# EasyEDA Pro project ProPrj_MN42_2025-04-09.epro, board btnBRD
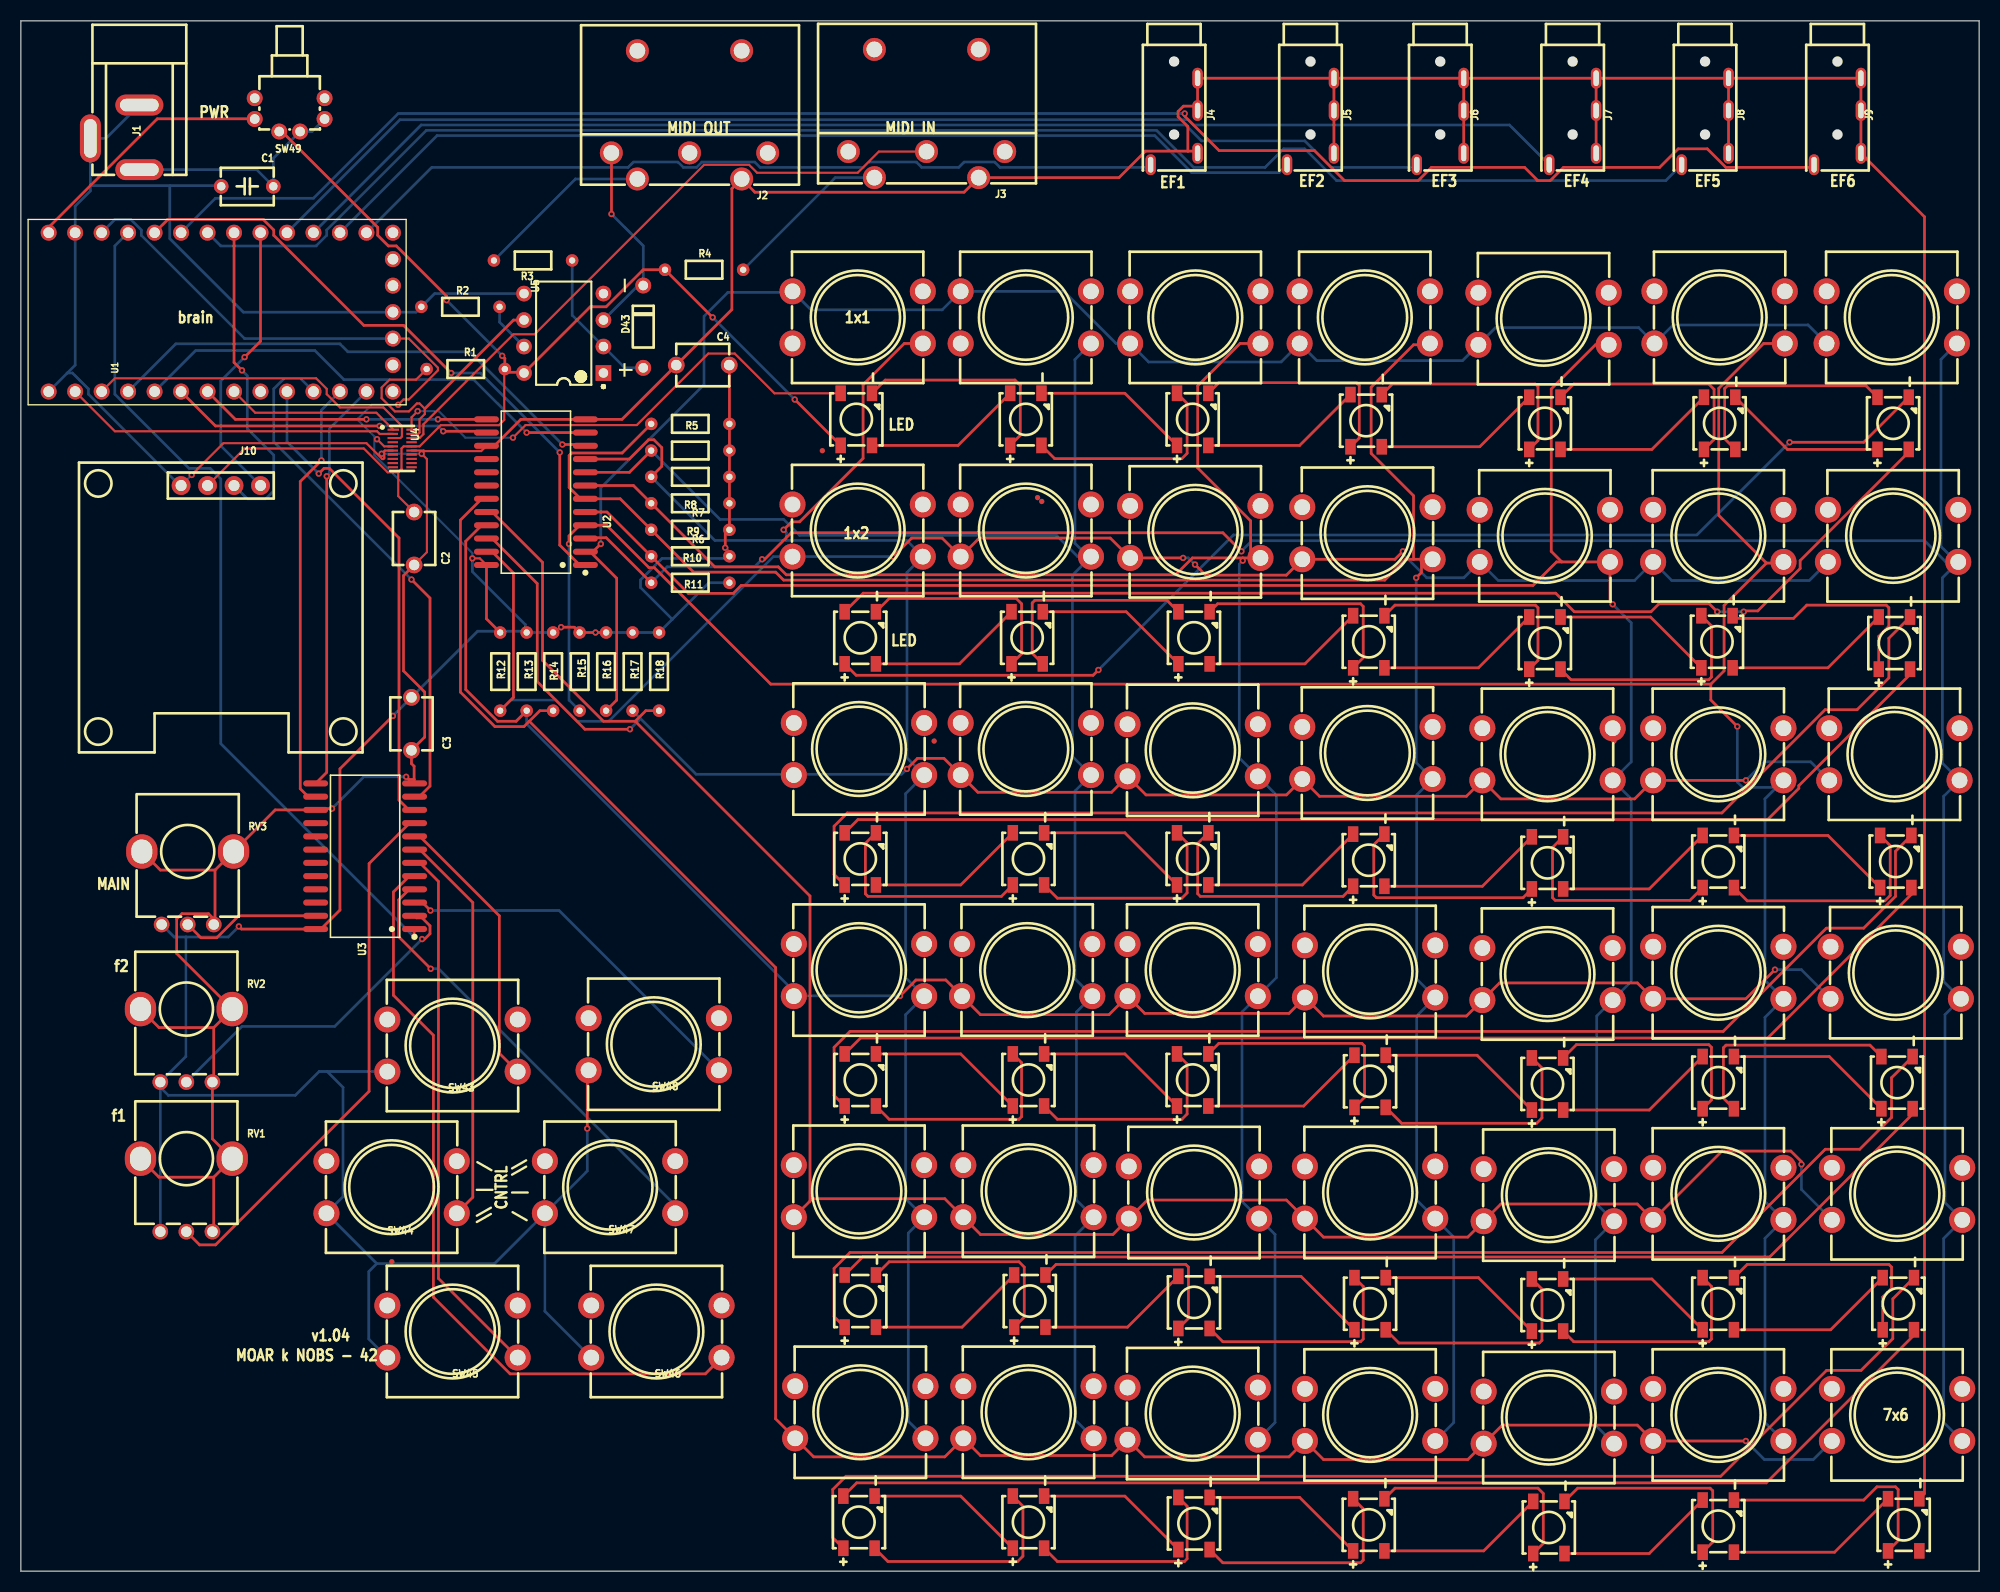
[diagram p1: board, top side]
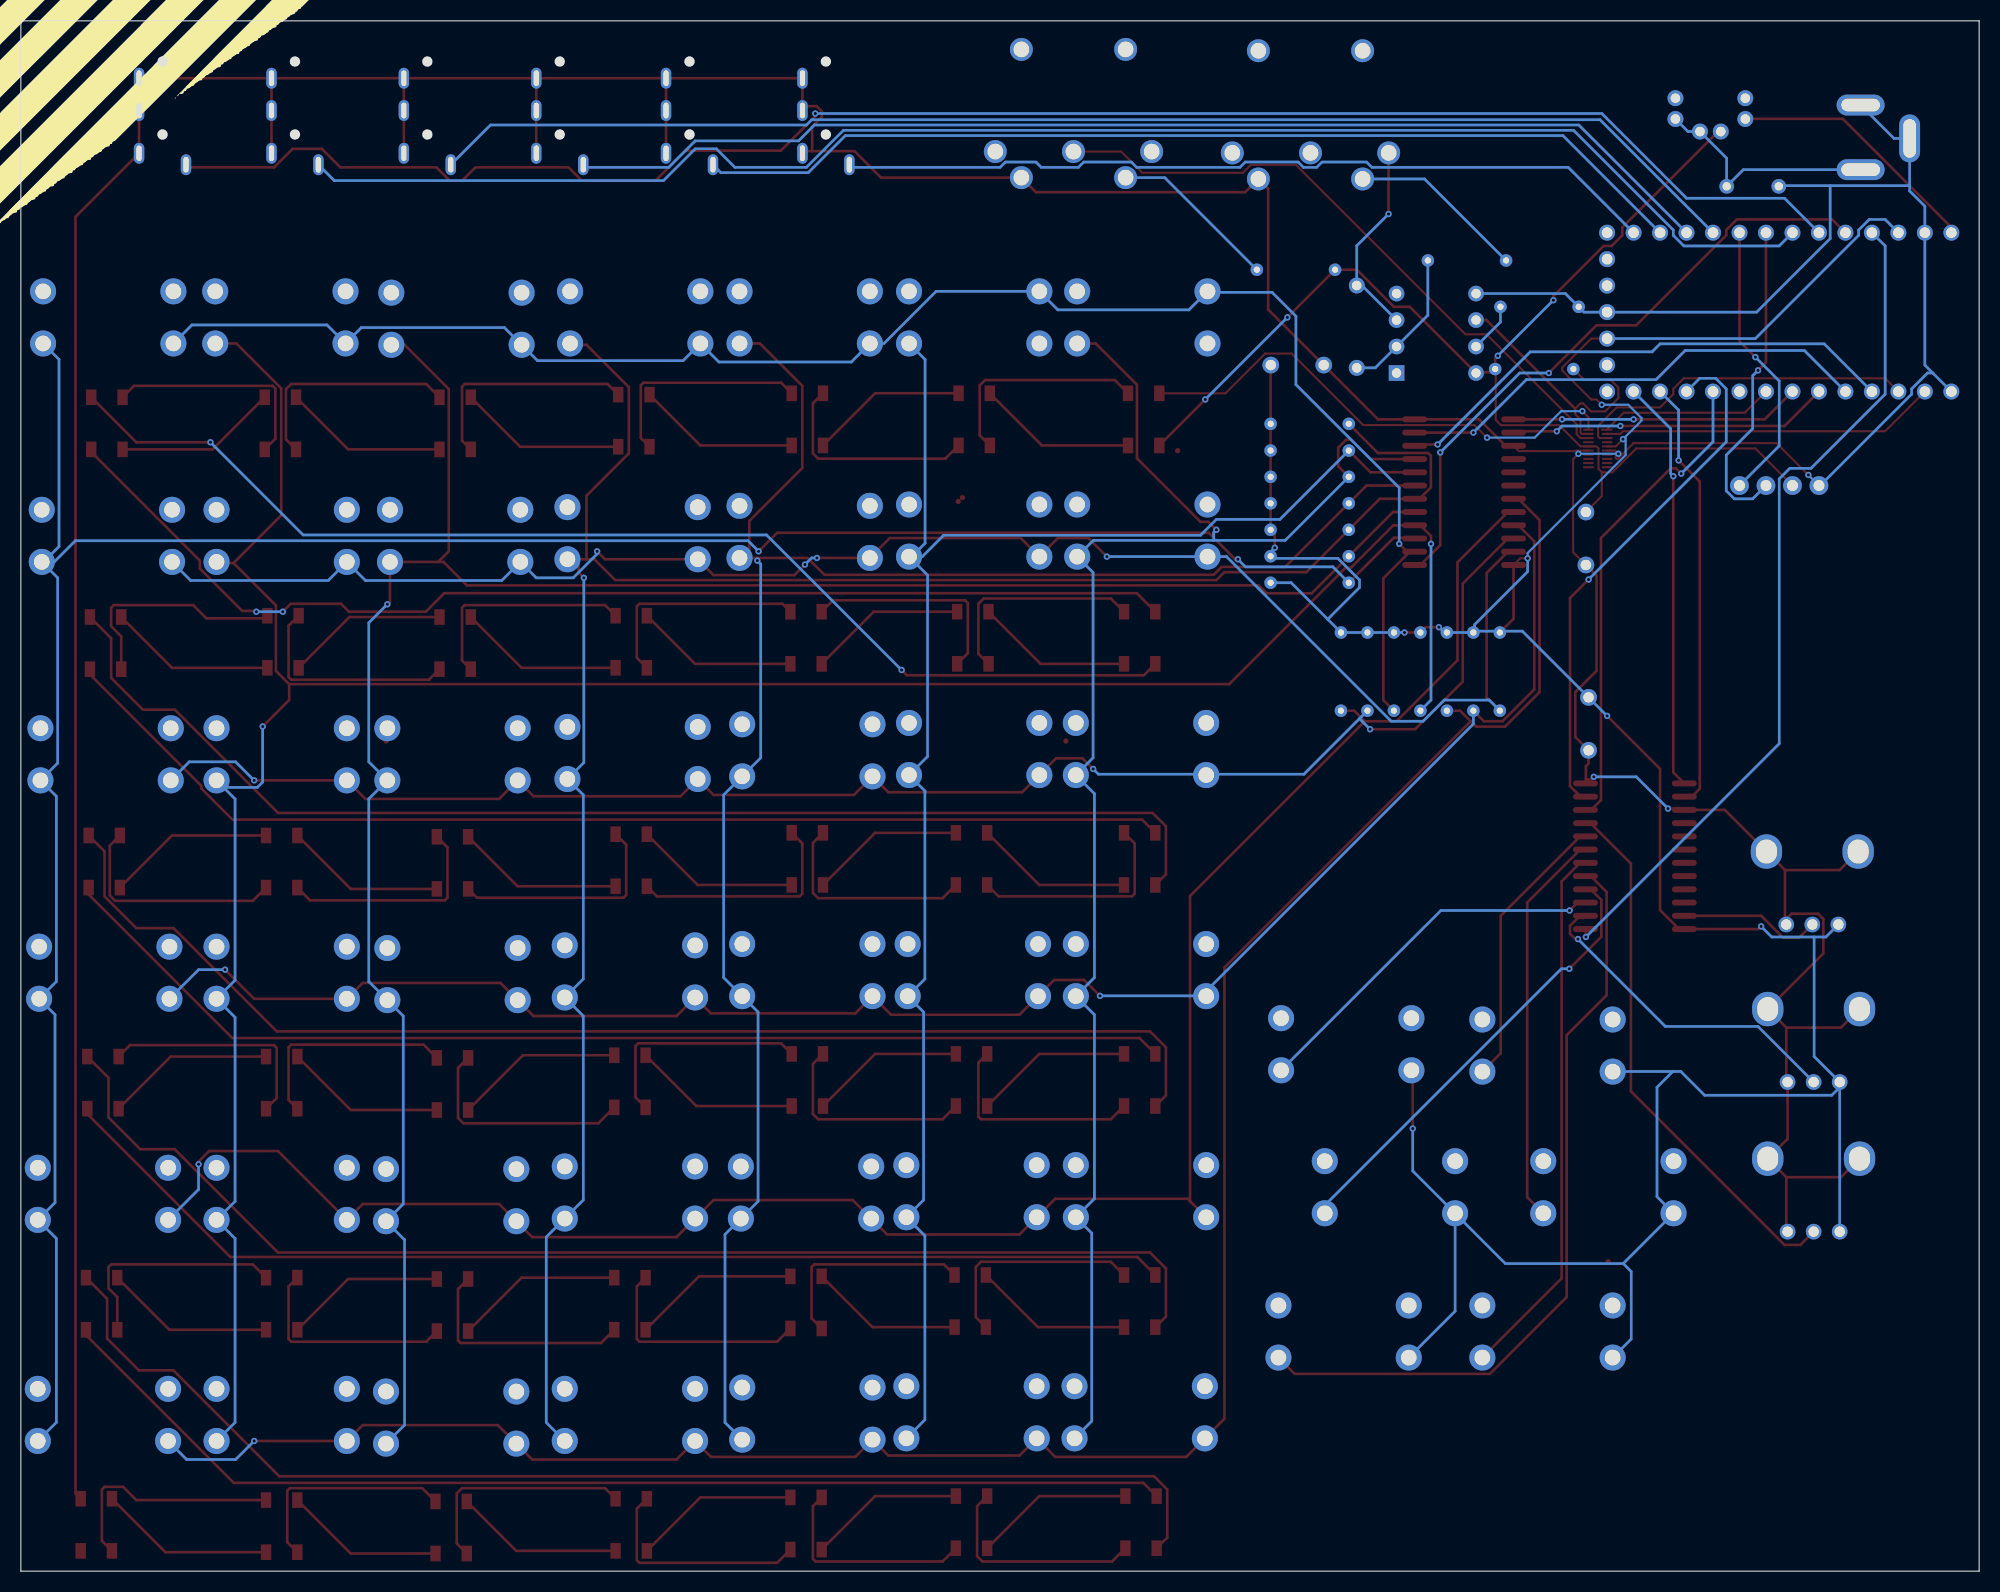
[diagram p2: board, bottom side, seen from below]

Outline 187.83 x 148.72 mm; copper layers: Top Layer, Bottom Layer. Coordinates in mm from the lower left corner of the outline.
Outline path: 0,148.72 0,0 187.83,0 187.83,148.72 0,148.72
Stack: Top Layer 0.035mm / Dielectric1 1.51mm FR4 er 4.5 / Bottom Layer 0.035mm

## Design rules (mm)
spacing safeClearance (default): track to track 0.152, other pairs 0.152 to 0.3
track width trackWidth (default): min 0.127, default 0.254, max 2.54
differential pair differentialPair (default): width min 0.127, default 0.254, max 2.54; gap min 0.152, default 0.152
via viaSize (default): diameter min 0.5, default 0.61, max 10; hole min 0.3, default 0.305, max 6

## Placement (name value [footprint] x y rotation side)
C1  10uF  [CAP-TH_L5.5-W3.5-P5.00-D0.5]  21.72 132.84 0 top
C2  100nF  [CAP-TH_L5.0-W4.0-P5.00-D1.0]  37.72 99.06 270 top
C3  100nF  [CAP-TH_L5.0-W4.0-P5.00-D1.0]  37.47 81.28 90 top
C4  100nF  [CAP-TH_L5.0-W4.0-P5.00-D1.0]  65.41 115.7 0 top
D1  XL-5050RGBC-WS2812B  [LED-SMD_4P-L5.0-W5.0-BL_XL-5050RGBC]  80.14 110.49 0 top
D2  XL-5050RGBC-WS2812B  [LED-SMD_4P-L5.0-W5.0-BL_XL-5050RGBC]  96.39 110.49 0 top
D3  XL-5050RGBC-WS2812B  [LED-SMD_4P-L5.0-W5.0-BL_XL-5050RGBC]  112.4 110.49 0 top
D4  XL-5050RGBC-WS2812B  [LED-SMD_4P-L5.0-W5.0-BL_XL-5050RGBC]  129.03 110.36 0 top
D5  XL-5050RGBC-WS2812B  [LED-SMD_4P-L5.0-W5.0-BL_XL-5050RGBC]  146.18 110.11 0 top
D6  XL-5050RGBC-WS2812B  [LED-SMD_4P-L5.0-W5.0-BL_XL-5050RGBC]  162.94 110.11 0 top
D7  XL-5050RGBC-WS2812B  [LED-SMD_4P-L5.0-W5.0-BL_XL-5050RGBC]  179.58 110.11 0 top
D8  XL-5050RGBC-WS2812B  [LED-SMD_4P-L5.0-W5.0-BL_XL-5050RGBC]  80.52 89.54 0 top
D9  XL-5050RGBC-WS2812B  [LED-SMD_4P-L5.0-W5.0-BL_XL-5050RGBC]  96.52 89.54 0 top
D10  XL-5050RGBC-WS2812B  [LED-SMD_4P-L5.0-W5.0-BL_XL-5050RGBC]  112.52 89.54 0 top
D11  XL-5050RGBC-WS2812B  [LED-SMD_4P-L5.0-W5.0-BL_XL-5050RGBC]  129.29 89.15 0 top
D12  XL-5050RGBC-WS2812B  [LED-SMD_4P-L5.0-W5.0-BL_XL-5050RGBC]  146.18 89.03 0 top
D13  XL-5050RGBC-WS2812B  [LED-SMD_4P-L5.0-W5.0-BL_XL-5050RGBC]  162.69 89.15 0 top
D14  XL-5050RGBC-WS2812B  [LED-SMD_4P-L5.0-W5.0-BL_XL-5050RGBC]  179.71 89.03 0 top
D15  XL-5050RGBC-WS2812B  [LED-SMD_4P-L5.0-W5.0-BL_XL-5050RGBC]  80.52 68.33 0 top
D16  XL-5050RGBC-WS2812B  [LED-SMD_4P-L5.0-W5.0-BL_XL-5050RGBC]  96.65 68.33 0 top
D17  XL-5050RGBC-WS2812B  [LED-SMD_4P-L5.0-W5.0-BL_XL-5050RGBC]  112.4 68.33 0 top
D18  XL-5050RGBC-WS2812B  [LED-SMD_4P-L5.0-W5.0-BL_XL-5050RGBC]  129.29 68.2 0 top
D19  XL-5050RGBC-WS2812B  [LED-SMD_4P-L5.0-W5.0-BL_XL-5050RGBC]  146.43 67.95 0 top
D20  XL-5050RGBC-WS2812B  [LED-SMD_4P-L5.0-W5.0-BL_XL-5050RGBC]  162.81 68.07 0 top
D21  XL-5050RGBC-WS2812B  [LED-SMD_4P-L5.0-W5.0-BL_XL-5050RGBC]  179.83 68.07 0 top
D22  XL-5050RGBC-WS2812B  [LED-SMD_4P-L5.0-W5.0-BL_XL-5050RGBC]  80.52 47.12 0 top
D23  XL-5050RGBC-WS2812B  [LED-SMD_4P-L5.0-W5.0-BL_XL-5050RGBC]  96.65 47.12 0 top
D24  XL-5050RGBC-WS2812B  [LED-SMD_4P-L5.0-W5.0-BL_XL-5050RGBC]  112.4 47.12 0 top
D25  XL-5050RGBC-WS2812B  [LED-SMD_4P-L5.0-W5.0-BL_XL-5050RGBC]  129.41 46.99 0 top
D26  XL-5050RGBC-WS2812B  [LED-SMD_4P-L5.0-W5.0-BL_XL-5050RGBC]  146.43 46.74 0 top
D27  XL-5050RGBC-WS2812B  [LED-SMD_4P-L5.0-W5.0-BL_XL-5050RGBC]  162.81 46.86 0 top
D28  XL-5050RGBC-WS2812B  [LED-SMD_4P-L5.0-W5.0-BL_XL-5050RGBC]  179.96 46.86 0 top
D29  XL-5050RGBC-WS2812B  [LED-SMD_4P-L5.0-W5.0-BL_XL-5050RGBC]  80.52 25.91 0 top
D30  XL-5050RGBC-WS2812B  [LED-SMD_4P-L5.0-W5.0-BL_XL-5050RGBC]  96.77 25.91 0 top
D31  XL-5050RGBC-WS2812B  [LED-SMD_4P-L5.0-W5.0-BL_XL-5050RGBC]  112.52 25.78 0 top
D32  XL-5050RGBC-WS2812B  [LED-SMD_4P-L5.0-W5.0-BL_XL-5050RGBC]  129.41 25.65 0 top
D33  XL-5050RGBC-WS2812B  [LED-SMD_4P-L5.0-W5.0-BL_XL-5050RGBC]  146.43 25.53 0 top
D34  XL-5050RGBC-WS2812B  [LED-SMD_4P-L5.0-W5.0-BL_XL-5050RGBC]  162.81 25.65 0 top
D35  XL-5050RGBC-WS2812B  [LED-SMD_4P-L5.0-W5.0-BL_XL-5050RGBC]  180.09 25.65 0 top
D36  XL-5050RGBC-WS2812B  [LED-SMD_4P-L5.0-W5.0-BL_XL-5050RGBC]  80.39 4.7 0 top
D37  XL-5050RGBC-WS2812B  [LED-SMD_4P-L5.0-W5.0-BL_XL-5050RGBC]  96.65 4.7 0 top
D38  XL-5050RGBC-WS2812B  [LED-SMD_4P-L5.0-W5.0-BL_XL-5050RGBC]  112.52 4.57 0 top
D39  XL-5050RGBC-WS2812B  [LED-SMD_4P-L5.0-W5.0-BL_XL-5050RGBC]  129.29 4.45 0 top
D40  XL-5050RGBC-WS2812B  [LED-SMD_4P-L5.0-W5.0-BL_XL-5050RGBC]  146.56 4.19 0 top
D41  XL-5050RGBC-WS2812B  [LED-SMD_4P-L5.0-W5.0-BL_XL-5050RGBC]  162.81 4.32 0 top
D42  XL-5050RGBC-WS2812B  [LED-SMD_4P-L5.0-W5.0-BL_XL-5050RGBC]  180.59 4.45 0 top
D43  1N4148PF  [DO-35_BD1.9-L3.9-P7.90-D0.5-FD]  59.7 119.38 90 top
J1  DC005  [DC-IN-TH_DC005]  9.02 137.54 270 top
J2  DIN-504B-M10  [CONN-TH_DIN-504B-M10]  64.14 139.7 180 top
J3  DIN-504B-M10  [CONN-TH_DIN-504B-M10]  86.87 139.83 180 top
J4  HC-PJ-320A  [AUDIO-SMD_HC-PJ-320A]  110.62 139.06 270 top
J5  HC-PJ-320A  [AUDIO-SMD_HC-PJ-320A]  123.7 139.06 270 top
J6  HC-PJ-320A  [AUDIO-SMD_HC-PJ-320A]  136.14 139.06 270 top
J7  HC-PJ-320A  [AUDIO-SMD_HC-PJ-320A]  148.84 139.06 270 top
J8  HC-PJ-320A  [AUDIO-SMD_HC-PJ-320A]  161.54 139.06 270 top
J9  HC-PJ-320A  [AUDIO-SMD_HC-PJ-320A]  174.24 139.06 270 top
J10  HS96L03W2C03  [OLED-TH_L27.8-W27.2-P2.54_C9900033791]  19.18 104.14 0 top
R1  220Ω  [RES-TH_BD1.7-L3.5-P7.50-D0.5]  42.67 115.32 0 top
R2  4.7kΩ  [RES-TH_BD1.7-L3.5-P7.50-D0.5]  42.16 121.29 0 top
R3  220Ω  [RES-TH_BD1.7-L3.5-P7.50-D0.5]  49.13 125.73 180 top
R4  220Ω  [RES-TH_BD1.7-L3.5-P7.50-D0.5]  65.53 124.84 0 top
R5  10kΩ  [RES-TH_BD1.7-L3.5-P7.50-D0.5]  64.21 110.06 0 top
R6  10kΩ  [RES-TH_BD1.7-L3.5-P7.50-D0.5]  64.21 107.5 0 top
R7  10kΩ  [RES-TH_BD1.7-L3.5-P7.50-D0.5]  64.21 104.98 0 top
R8  10kΩ  [RES-TH_BD1.7-L3.5-P7.50-D0.5]  64.21 102.44 0 top
R9  10kΩ  [RES-TH_BD1.7-L3.5-P7.50-D0.5]  64.21 99.9 0 top
R10  10kΩ  [RES-TH_BD1.7-L3.5-P7.50-D0.5]  64.21 97.36 0 top
R11  10kΩ  [RES-TH_BD1.7-L3.5-P7.50-D0.5]  64.21 94.82 0 top
R12  10kΩ  [RES-TH_BD1.7-L3.5-P7.50-D0.5]  45.97 86.29 90 top
R13  10kΩ  [RES-TH_BD1.7-L3.5-P7.50-D0.5]  48.51 86.29 90 top
R14  10kΩ  [RES-TH_BD1.7-L3.5-P7.50-D0.5]  51.05 86.29 90 top
R15  10kΩ  [RES-TH_BD1.7-L3.5-P7.50-D0.5]  53.59 86.29 90 top
R16  10kΩ  [RES-TH_BD1.7-L3.5-P7.50-D0.5]  56.13 86.29 90 top
R17  10kΩ  [RES-TH_BD1.7-L3.5-P7.50-D0.5]  58.67 86.29 90 top
R18  10kΩ  [RES-TH_BD1.7-L3.5-P7.50-D0.5]  61.21 86.29 90 top
RV1  10kΩ  [RES-ADJ-TH_RK09K1130A5R]  15.88 36.07 0 top
RV2  10kΩ  [RES-ADJ-TH_RK09K1130A5R]  15.88 50.42 0 top
RV3  10kΩ  [RES-ADJ-TH_RK09K1130A5R]  16 65.53 0 top
SW1  HX B3F-4055-Y  [SW-TH_4P-L12.0-W12.0-P5.00-LS12.5]  80.26 120.27 180 top
SW2  HX B3F-4055-Y  [SW-TH_4P-L12.0-W12.0-P5.00-LS12.5]  96.39 120.27 180 top
SW3  HX B3F-4055-Y  [SW-TH_4P-L12.0-W12.0-P5.00-LS12.5]  112.65 120.27 180 top
SW4  HX B3F-4055-Y  [SW-TH_4P-L12.0-W12.0-P5.00-LS12.5]  128.91 120.27 180 top
SW5  HX B3F-4055-Y  [SW-TH_4P-L12.0-W12.0-P5.00-LS12.5]  146.05 120.14 180 top
SW6  HX B3F-4055-Y  [SW-TH_4P-L12.0-W12.0-P5.00-LS12.5]  162.94 120.27 180 top
SW7  HX B3F-4055-Y  [SW-TH_4P-L12.0-W12.0-P5.00-LS12.5]  179.45 120.27 180 top
SW8  HX B3F-4055-Y  [SW-TH_4P-L12.0-W12.0-P5.00-LS12.5]  80.26 99.82 180 top
SW9  HX B3F-4055-Y  [SW-TH_4P-L12.0-W12.0-P5.00-LS12.5]  96.39 99.82 180 top
SW10  HX B3F-4055-Y  [SW-TH_4P-L12.0-W12.0-P5.00-LS12.5]  112.65 99.7 180 top
SW11  HX B3F-4055-Y  [SW-TH_4P-L12.0-W12.0-P5.00-LS12.5]  129.16 99.57 180 top
SW12  HX B3F-4055-Y  [SW-TH_4P-L12.0-W12.0-P5.00-LS12.5]  146.18 99.31 180 top
SW13  HX B3F-4055-Y  [SW-TH_4P-L12.0-W12.0-P5.00-LS12.5]  162.81 99.31 180 top
SW14  HX B3F-4055-Y  [SW-TH_4P-L12.0-W12.0-P5.00-LS12.5]  179.58 99.31 180 top
SW15  HX B3F-4055-Y  [SW-TH_4P-L12.0-W12.0-P5.00-LS12.5]  80.39 78.87 180 top
SW16  HX B3F-4055-Y  [SW-TH_4P-L12.0-W12.0-P5.00-LS12.5]  96.39 78.87 180 top
SW17  HX B3F-4055-Y  [SW-TH_4P-L12.0-W12.0-P5.00-LS12.5]  112.4 78.74 180 top
SW18  HX B3F-4055-Y  [SW-TH_4P-L12.0-W12.0-P5.00-LS12.5]  129.16 78.49 180 top
SW19  HX B3F-4055-Y  [SW-TH_4P-L12.0-W12.0-P5.00-LS12.5]  146.43 78.36 180 top
SW20  HX B3F-4055-Y  [SW-TH_4P-L12.0-W12.0-P5.00-LS12.5]  162.81 78.36 180 top
SW21  HX B3F-4055-Y  [SW-TH_4P-L12.0-W12.0-P5.00-LS12.5]  179.71 78.36 180 top
SW22  HX B3F-4055-Y  [SW-TH_4P-L12.0-W12.0-P5.00-LS12.5]  80.39 57.66 180 top
SW23  HX B3F-4055-Y  [SW-TH_4P-L12.0-W12.0-P5.00-LS12.5]  96.52 57.66 180 top
SW24  HX B3F-4055-Y  [SW-TH_4P-L12.0-W12.0-P5.00-LS12.5]  112.4 57.66 180 top
SW25  HX B3F-4055-Y  [SW-TH_4P-L12.0-W12.0-P5.00-LS12.5]  129.41 57.53 180 top
SW26  HX B3F-4055-Y  [SW-TH_4P-L12.0-W12.0-P5.00-LS12.5]  146.43 57.28 180 top
SW27  HX B3F-4055-Y  [SW-TH_4P-L12.0-W12.0-P5.00-LS12.5]  162.81 57.4 180 top
SW28  HX B3F-4055-Y  [SW-TH_4P-L12.0-W12.0-P5.00-LS12.5]  179.83 57.4 180 top
SW29  HX B3F-4055-Y  [SW-TH_4P-L12.0-W12.0-P5.00-LS12.5]  80.39 36.45 180 top
SW30  HX B3F-4055-Y  [SW-TH_4P-L12.0-W12.0-P5.00-LS12.5]  96.65 36.45 180 top
SW31  HX B3F-4055-Y  [SW-TH_4P-L12.0-W12.0-P5.00-LS12.5]  112.52 36.32 180 top
SW32  HX B3F-4055-Y  [SW-TH_4P-L12.0-W12.0-P5.00-LS12.5]  129.41 36.32 180 top
SW33  HX B3F-4055-Y  [SW-TH_4P-L12.0-W12.0-P5.00-LS12.5]  146.56 36.07 180 top
SW34  HX B3F-4055-Y  [SW-TH_4P-L12.0-W12.0-P5.00-LS12.5]  162.81 36.2 180 top
SW35  HX B3F-4055-Y  [SW-TH_4P-L12.0-W12.0-P5.00-LS12.5]  179.96 36.2 180 top
SW36  HX B3F-4055-Y  [SW-TH_4P-L12.0-W12.0-P5.00-LS12.5]  80.52 15.24 180 top
SW37  HX B3F-4055-Y  [SW-TH_4P-L12.0-W12.0-P5.00-LS12.5]  96.65 15.24 180 top
SW38  HX B3F-4055-Y  [SW-TH_4P-L12.0-W12.0-P5.00-LS12.5]  112.4 15.11 180 top
SW39  HX B3F-4055-Y  [SW-TH_4P-L12.0-W12.0-P5.00-LS12.5]  129.41 14.99 180 top
SW40  HX B3F-4055-Y  [SW-TH_4P-L12.0-W12.0-P5.00-LS12.5]  146.56 14.73 180 top
SW41  HX B3F-4055-Y  [SW-TH_4P-L12.0-W12.0-P5.00-LS12.5]  162.81 14.99 180 top
SW42  HX B3F-4055-Y  [SW-TH_4P-L12.0-W12.0-P5.00-LS12.5]  179.96 14.99 180 top
SW43  HX B3F-4055-Y  [SW-TH_4P-L12.0-W12.0-P5.00-LS12.5]  41.4 50.42 180 top
SW44  HX B3F-4055-Y  [SW-TH_4P-L12.0-W12.0-P5.00-LS12.5]  35.56 36.83 180 top
SW45  HX B3F-4055-Y  [SW-TH_4P-L12.0-W12.0-P5.00-LS12.5]  41.4 22.99 180 top
SW46  HX B3F-4055-Y  [SW-TH_4P-L12.0-W12.0-P5.00-LS12.5]  60.96 22.99 180 top
SW47  HX B3F-4055-Y  [SW-TH_4P-L12.0-W12.0-P5.00-LS12.5]  56.52 36.83 180 top
SW48  HX B3F-4055-Y  [SW-TH_4P-L12.0-W12.0-P5.00-LS12.5]  60.71 50.55 180 top
SW49  pwr switch  [SW-TH_TK-6580A-1]  25.78 139.7 180 top
U1  brain - teensy 4.0  [teensy 4.0:MODULE_DEV-15583]  19.18 120.78 90 top
U2  CD74HC4067M96  [SOIC-24_L15.4-W7.5-P1.27-LS10.3-BL]  49.4 103.51 90 top
U3  CD74HC4067M96  [SOIC-24_L15.4-W7.5-P1.27-LS10.3-BL]  33.02 68.58 90 top
U4  TXB0108DQSR  [SON-20_L4.0-W2.0-P0.40-BL]  36.58 107.7 270 top
U5  6N138  [DIP-8_L9.8-W6.6-P2.54-LS7.6-BL]  52.07 118.75 90 top

## Footprints (pads in the part's own frame, mm; a bottom-side part is the same pattern mirrored in y, then rotated)
AUDIO-SMD_HC-PJ-320A
  oval 2x1 hole 1.5x0.5: 1(4.15,-2.25) 2(-4.15,2.25) 3(-1.05,2.25) 4(3.05,2.25)
CAP-TH_L5.0-W4.0-P5.00-D1.0
  round 1.6 hole 1: 1(-2.54,0) 2(2.54,0)
CAP-TH_L5.5-W3.5-P5.00-D0.5
  round 1.4 hole 0.8: 1(-2.5,0) 2(2.5,0)
CONN-TH_DIN-504B-M10
  round 2.2 hole 1.5: 1(-7.5,3.65) 2(-5,6.15) 3(0,3.65) 4(5,6.15) 5(7.5,3.65) 6(-5,-6.15) 7(5,-6.15)
DC-IN-TH_DC005
  oval 2x4.6 hole 1.2x3.7: 1(3.1,2.35) 2(-3.1,2.35)
  oval 4.6x2 hole 3.7x1.2: 3(0.1,-2.35)
DIP-8_L9.8-W6.6-P2.54-LS7.6-BL
  rect 1.5x1.5 hole 0.9: 1(-3.81,-3.81)
  round 1.5 hole 0.9: 2(-1.27,-3.81) 3(1.27,-3.81) 4(3.81,-3.81) 5(3.81,3.81) 6(1.27,3.81) 7(-1.27,3.81) 8(-3.81,3.81)
DO-35_BD1.9-L3.9-P7.90-D0.5-FD
  round 1.524 hole 0.914: 1(-3.95,0) 2(3.95,0)
LED-SMD_4P-L5.0-W5.0-BL_XL-5050RGBC
  rect 1x1.5 smd: 1(-1.5,-2.5) 2(1.5,-2.5) 3(1.5,2.5) 4(-1.5,2.5)
OLED-TH_L27.8-W27.2-P2.54_C9900033791
  round 1.8 hole 1.05: 1(-3.81,0) 2(-1.27,0) 3(1.27,0) 4(3.81,0)
RES-ADJ-TH_RK09K1130A5R
  round 1.5 hole 1: 1(-2.5,-3.5) 2(0,-3.5) 3(2.5,-3.5)
  oval 3x3.3 hole 2x2.3: 4(4.4,3.5) 5(-4.4,3.5)
RES-TH_BD1.7-L3.5-P7.50-D0.5
  round 1.2 hole 0.6: 1(-3.75,0) 2(3.75,0)
SOIC-24_L15.4-W7.5-P1.27-LS10.3-BL
  oval 0.574x2.388 smd: 1(-6.985,-4.744) 2(-5.715,-4.744) 3(-4.445,-4.744) 4(-3.175,-4.744) 5(-1.905,-4.744) 6(-0.635,-4.744) 7(0.635,-4.744) 8(1.905,-4.744) 9(3.175,-4.744) 10(4.445,-4.744) 11(5.715,-4.744) 12(6.985,-4.744) 13(6.985,4.744) 14(5.715,4.744) 15(4.445,4.744) 16(3.175,4.744) 17(1.905,4.744) 18(0.635,4.744) 19(-0.635,4.744) 20(-1.905,4.744) 21(-3.175,4.744) 22(-4.445,4.744) 23(-5.715,4.744) 24(-6.985,4.744)
SON-20_L4.0-W2.0-P0.40-BL
  rect 0.2x1.1 smd: 1(-1.8,-0.85)
  rect 0.2x1 smd: 2(-1.4,-0.9) 3(-1,-0.9) 4(-0.6,-0.9) 5(-0.2,-0.9) 6(0.2,-0.9) 7(0.6,-0.9) 8(1,-0.9) 9(1.4,-0.9) 10(1.8,-0.9) 11(1.8,0.9) 12(1.4,0.9) 13(1,0.9) 14(0.6,0.9) 15(0.2,0.9) 16(-0.2,0.9) 17(-0.6,0.9) 18(-1,0.9) 19(-1.4,0.9) 20(-1.8,0.9)
SW-TH_4P-L12.0-W12.0-P5.00-LS12.5
  round 2.5 hole 1.5: 1(-6.25,2.5) 2(6.25,2.5) 3(-6.25,-2.5) 4(6.25,-2.5)
SW-TH_TK-6580A-1
  round 1.524 hole 0.914: 1(3.35,-1.6) 2(3.35,0.4) 3(-3.35,-1.6) 4(-3.35,0.4) 5(1,1.6) 6(-1,1.6)
teensy 4.0:MODULE_DEV-15583
  round 1.53 hole 1.02: 0(-7.62,13.97) 1(-7.62,11.43) 2(-7.62,8.89) 3(-7.62,6.35) 3.3V_1(-2.54,-16.51) 3.3V_2(7.62,11.43) 4(-7.62,3.81) 5(-7.62,1.27) 6(-7.62,-1.27) 7(-7.62,-3.81) 8(-7.62,-6.35) 9(-7.62,-8.89) 10(-7.62,-11.43) 11(-7.62,-13.97) 12(-7.62,-16.51) 13(7.62,-16.51) 14(7.62,-13.97) 15(7.62,-11.43) 16(7.62,-8.89) 17(7.62,-6.35) 18(7.62,-3.81) 19(7.62,-1.27) 20(7.62,1.27) 21(7.62,3.81) 22(7.62,6.35) 23(7.62,8.89) G1(-7.62,16.51) G2(0,-16.51) G3(7.62,13.97) ON-OFF(5.08,-16.51) PGM(2.54,-16.51) VBAT(-5.08,-16.51) VIN(7.62,16.51)

## Nets
As in the schematic.

Pads without a net: D42 2; J2 1 3 6 7; J3 1 5 6 7; SW1 2 3; SW2 2 3; SW3 3 4; SW4 3 4; SW5 3 4; SW6 3 4; SW7 3 4; SW8 3 4; SW9 3 4; SW10 3 4; SW11 3 4; SW12 3 4; SW13 3 4; SW14 3 4; SW15 3 4; SW16 3 4; SW17 3 4; SW18 3 4; SW19 3 4; SW20 3 4; SW21 3 4; SW22 3 4; SW23 3 4; SW24 3 4; SW25 3 4; SW26 3 4; SW27 3 4; SW28 3 4; SW29 3 4; SW30 3 4; SW31 3 4; SW32 3 4; SW33 3 4; SW34 3 4; SW35 3 4; SW36 3 4; SW37 3 4; SW38 3 4; SW39 3 4; SW40 3 4; SW41 3 4; SW42 3 4; SW43 3 4; SW44 3 4; SW45 3 4; SW46 3 4; SW47 3 4; SW48 3 4; SW49 1 3; U1 7 12 13 ON-OFF PGM VBAT; U2 16 17 18; U3 16 17 18 19 20 21 22; U4 4 7 8 9 10 11 12 13 14 17; U5 1 4

## Via types
v1: diameter 0.61, hole 0.305, Top Layer to Bottom Layer, 64 vias

## Routing (per net, layer and track width the routed paths; a pad name or vN(x,y) marks a point on that pad's centre or on a via; arc(x,y) is an arc through that point)
3VDC: length 331.8
  Top Layer w0.2: v1(36.2,111.89) 36.7,112.4 37.21,112.4 40,115.19 40,115.44 37.21,118.24 U1.3.3V_1 ; v1(43.31,97.16) 44.02,97.16 U2.24 ; v1(34.16,108.59) 34.85,107.9 U4.5
  Top Layer w0.254: v1(20.91,61.85) 21.16,61.6 U3.24 28.78,61.6 30.61,63.42 30.61,76.96 v1(35.69,82.04) ; v1(67.56,98.17) 67.56,99.5 R9.2 R8.2 R7.2 R6.2 R5.2 67.96,115.68 C4.2 ; v1(51.82,90.55) 53.09,90.55 R15.2 v1(55.12,90.04) R16.2 ; R12.2 44.66,91.36 U2.24 ; SW48.2 54.33,47.92 v1(54.33,42.46)
  Bottom Layer w0.2: 33.91,108.84 33.91,107.06 43.31,97.66 v1(43.31,97.16) ; 33.91,108.84 32.39,110.36 32.39,110.62 33.66,111.89 v1(36.2,111.89) ; 33.91,108.84 v1(34.16,108.59)
  Bottom Layer w0.254: 29.38,47.94 30.9,46.41 30.9,35.92 SW44.2 34.14,29.5 ; 29.38,47.94 28.61,47.94 26.33,45.65 14.14,45.65 13.38,46.41 ; 29.38,47.94 35.14,47.94 SW43.2 ; 34.14,29.5 45.44,29.5 SW47.2 ; 34.14,29.5 33.37,28.74 33.37,22.27 SW45.2 ; v1(55.12,90.04) R16.2 R17.2 R18.2 62.48,91.31 ; 67.82,97.41 67.56,97.15 61.51,97.15 59.44,95.08 59.44,94.36 62.48,91.31 ; 67.82,97.41 67.82,97.92 v1(67.56,98.17) ; 67.82,97.41 R10.2 ; v1(54.33,42.46) 54.33,38.39 SW47.2 ; 15.83,60.83 19.89,60.83 v1(20.91,61.85) ; 15.83,60.83 14.7,60.83 RV3.1 ; 15.83,60.83 15.83,49.37 RV2.1 13.38,46.41 ; SW47.2 50.27,24.93 SW46.2 ; 48.39,90.17 43.81,90.17 C3.2 v1(35.69,82.04) ; 48.39,90.17 R13.2 R14.2 51.31,90.04 v1(51.82,90.55) ; 48.39,90.17 48.39,90.81 43.31,95.89 v1(43.31,97.16) ; U1.3.3V_2 9.02,129.67 10.54,129.67 11.56,128.65 11.56,128.14 21.46,118.24 U1.3.3V_1 ; 13.38,46.41 RV1.1 ; 62.48,91.31 65.99,94.82 R11.2
5VDC: length 119.2
  Top Layer w0.2: 36.2,105.41 35.18,105.41 32.89,107.7 21.46,107.7 J10.2 ; 36.2,105.41 36.51,105.73 36.51,107.7 36.71,107.9 U4.16 38.24,107.9 40.27,109.93 45.86,109.93 46.37,110.44 46.37,115.26 R1.2 ; 36.2,105.41 36.2,103.12 C2.1
  Top Layer w0.254: v1(40.83,121.92) 40.83,122.3 36.01,127.13 35.25,127.13 34.23,128.14 34.23,128.91 25.09,138.05 24.83,138.05 SW49.5 ; v1(46.17,116.59) 46.42,116.33 R1.2 ; 74.23,112.4 D1.1 ; v1(66.35,120.27) R4.1 59.69,124.84 56.13,121.29 54.61,121.29 U5.8 48.19,115.01 46.37,115.01
  Bottom Layer w0.254: v1(66.35,120.27) v1(74.23,112.4) ; v1(46.17,116.59) v1(40.83,121.92)
GND: length 591.2
  Top Layer w0.2: U4.15 38.64,107.5 38.69,107.44 ; C2.2 38.95,97.75 38.95,106.68 v1(38.44,107.19) 38.69,107.44 ; U4.6 34.91,107.5 34.86,107.44 34.86,107.19 ; v1(16.38,105.16) 19.43,108.2 33.15,108.2 34.67,106.68 34.77,106.68 34.86,106.77 34.86,107.19 ; 38.69,107.44 44.15,107.44 U2.15 ; 34.86,107.19 v1(34.61,107.19)
  Top Layer w0.254: J7.2 J8.2 ; J7.2 J7.3 J7.4 ; J7.2 J6.2 ; J8.2 J8.3 J8.4 ; J8.2 J9.2 J9.3 J9.4 182.59,129.92 182.59,7.44 D42.3 ; 18.5,37.79 13.25,37.79 RV1.5 ; 18.5,37.79 RV1.4 18.38,41.47 RV2.3 18.5,47.04 18.5,52.14 ; 18.5,37.79 18.5,32.69 RV1.3 ; 37.72,75.95 37.21,75.95 v1(36.96,76.2) ; 37.72,75.95 37.72,75.61 U3.12 ; 37.72,75.95 37.72,77.22 37.47,77.47 C3.1 38.73,80.01 38.73,84.33 36.7,86.36 36.7,95.5 C2.2 ; 111.93,136.22 112.66,136.22 J4.4 ; 111.93,136.22 111.93,138.59 111,139.52 111,140.03 111.51,140.54 112.45,140.54 J4.3 J4.2 J5.2 ; 111.93,136.22 107.87,136.22 105.33,133.68 J3.2 90.47,132.28 70.41,132.28 J2.2 68.2,132.61 68.2,121.03 C4.1 57.66,110.49 U2.12 47.96,110.49 45.42,107.95 U2.15 ; v1(29.84,73.15) 28.4,73.15 U3.15 24.39,73.03 RV3.4 18.62,67.25 ; RV2.5 13.25,52.14 18.5,52.14 ; J6.2 J6.3 J6.4 ; J6.2 J5.2 ; 18.5,62.56 18.62,62.68 18.62,67.25 ; 18.5,62.56 17.99,63.07 15.45,63.07 14.95,62.56 14.95,59.25 RV2.4 18.5,52.14 ; 18.5,62.56 RV3.3 ; 11.6,69.03 13.38,67.25 18.62,67.25 ; J5.2 J5.3 J5.4
  Bottom Layer w0.2: J10.1 v1(16.38,105.16) ; v1(34.61,107.19) v1(38.44,107.19)
  Bottom Layer w0.254: 6.67,132.91 6.67,132.4 5.21,130.94 U1.G3 5.21,115.7 4.45,114.94 ; 6.67,132.91 J1.3 8.17,137.44 J1.2 ; 6.67,132.91 14.29,132.91 ; U1.G1 4.45,114.94 ; 4.45,114.94 4.95,114.94 6.48,113.41 6.48,112.9 15.11,104.27 15.24,104.27 J10.1 ; 14.29,132.91 19.15,132.91 C1.1 ; 14.29,132.91 14.29,127.83 21.33,120.78 U1.G2 37.91,120.78 R2.1 39.68,122.56 48.26,122.56 ; v1(29.84,73.15) 32.89,76.2 v1(36.96,76.2)
COL1: length 162.2
  Top Layer w0.254: R16.1 57.15,83.56 57.15,95.24 54.61,97.78 ; 54.61,97.78 54.16,97.78 U2.2 ; 54.61,97.78 54.86,97.78 v1(55.63,98.54)
  Bottom Layer w0.254: v1(55.63,98.54) 55.63,103.92 65.53,113.83 65.53,120.39 67.82,122.67 73.92,122.67 SW1.4 75.79,120.99 88.37,120.99 SW2.4 100.05,122.77 105.05,117.77 SW3.2 108.18,115.99 120.88,115.99 SW4.2 124.31,116.12 138.28,116.12 SW5.2 141.45,119.29 155.17,119.29 SW6.2 158.47,119.55 171.42,119.55 SW7.2
COL2: length 161.7
  Top Layer w0.254: v1(111.48,97.2) SW10.2 104.49,99.1 91.92,99.1 SW9.2 88.37,99.1 85.44,99.1 v1(83.67,97.32) ; v1(112.62,96.56) 113.64,95.54 121.38,95.54 SW11.2 131.8,97.07 v1(132.56,97.83) ; U2.23 45.2,97.79 47.24,95.75 47.24,83.81 R12.1
  Bottom Layer w0.254: SW14.2 171.55,95.04 158.34,95.04 SW13.2 154.79,95.04 141.71,95.04 SW12.2 138.4,95.29 134.85,95.29 132.56,97.58 v1(132.56,97.83) ; v1(111.48,97.2) 111.99,97.2 v1(112.62,96.56) ; v1(83.67,97.32) SW8.2 72.18,97.32 56.39,81.53 53.34,81.53 51.31,83.56 46.99,83.56 R12.1
COL3: length 153.9
  Top Layer w0.254: U2.22 44.67,99.05 45.21,99.05 49.53,94.73 49.53,85.34 54.1,80.76 v1(58.42,80.76) ; v1(165.45,75.86) SW20.2 154.79,74.08 141.96,74.08 SW19.2 138.66,74.34 124.56,74.34 SW18.2 121.38,74.46 107.92,74.46 SW17.2 104.62,74.72 91.79,74.72 SW16.2 88.54,77.97 86,77.97 v1(84.98,76.95)
  Bottom Layer w0.254: v1(84.98,76.95) 84.48,76.45 74.06,76.45 ; 74.06,76.45 64.77,76.45 59.44,81.78 ; 74.06,76.45 SW15.2 ; R17.1 59.44,81.78 ; 59.44,81.78 v1(58.42,80.76) ; v1(165.45,75.86) 167.23,77.64 171.68,77.64 SW21.2
COL4: length 170.9
  Top Layer w0.254: R13.1 47.5,81.53 45.72,81.53 42.67,84.57 42.67,98.8 44.2,100.33 U2.21 ; v1(84.33,55.19) 85.85,56.71 88.72,56.71 SW23.2 92.05,53.38 104.37,53.38 SW24.2 107.8,53.51 121.64,53.51 SW25.2 124.94,53.25 138.66,53.25 SW26.2 141.83,56.43 155.04,56.43 SW27.2 165.45,54.9 v1(168.25,57.7)
  Bottom Layer w0.254: SW28.2 170.79,57.7 v1(168.25,57.7) ; 74.17,55.19 74.17,55.62 48.51,81.27 R13.1 ; 74.17,55.19 SW22.2 ; 74.17,55.19 v1(84.33,55.19)
COL5: length 197.3
  Top Layer w0.254: v1(170.79,39.03) 170.79,39.28 169.77,40.3 163.17,40.3 SW34.2 155.04,35.22 141.96,35.22 SW33.2 138.78,32.04 124.94,32.04 SW32.2 121.38,35.6 108.05,35.6 SW31.2 104.75,32.3 92.05,32.3 SW30.2 88.62,35.73 75.92,35.73 75.69,35.5 ; 58.93,81.53 75.69,64.76 75.69,35.5 ; 58.93,81.53 55.88,81.53 50.04,87.37 50.04,96.77 45.21,101.59 44.67,101.59 U2.20 ; 58.93,81.53 59.94,82.54 R18.1 ; SW29.2 75.69,35.5
  Bottom Layer w0.254: SW35.2 170.79,36.62 v1(170.79,39.03)
COL6: length 217.8
  Top Layer w0.254: 48.77,81.53 48.26,81.02 45.47,81.02 42.16,84.32 42.16,100.83 44.2,102.87 U2.19 ; 48.77,81.53 49.78,82.54 R14.1 ; 48.77,81.53 72.39,57.9 72.39,14.62 SW36.2 76.05,10.96 88.62,10.96 SW37.2 92.05,11.09 104.62,11.09 SW38.2 107.8,10.96 121.64,10.96 SW39.2 124.94,10.71 138.78,10.71 SW40.2 142.09,14.01 155.04,14.01 SW41.2 v1(165.45,12.49)
  Bottom Layer w0.254: v1(165.45,12.49) 167.23,10.71 171.93,10.71 SW42.2
CTRL1: length 27
  Top Layer w0.254: U3.8 38.27,70.49 45.89,62.87 45.89,49.68 SW43.1
CTRL2: length 38.1
  Top Layer w0.254: SW44.1 43.35,35.87 43.35,64.14 38.27,69.22 U3.7
CTRL3: length 51.9
  Top Layer w0.254: SW45.1 40.05,28.09 40.05,66.17 38.27,67.95 U3.6
CTRL4: length 74.5
  Top Layer w0.254: SW46.1 65.65,18.92 46.93,18.92 39.56,26.29 39.56,51.41 35.73,55.25 35.73,65.15 37.26,66.68 U3.5
CTRL5: length 43.4
  Top Layer w0.254: v1(39.31,57.79) 36.24,60.86 36.24,64.39 37.26,65.41 U3.4
  Bottom Layer w0.254: SW47.1 62.68,34.42 62.68,35.18 40.07,57.79 v1(39.31,57.79)
CTRL6: length 35.9
  Top Layer w0.254: U3.3 38.53,64.14 v1(39.29,63.37)
  Bottom Layer w0.254: v1(39.29,63.37) 51.63,63.37 SW48.1
E1: length 79.6
  Bottom Layer w0.254: J4.1 108.11,134.66 93.91,134.66 93.41,135.17 90.47,135.17 89.96,134.66 86.4,134.66 85.89,135.17 81.32,135.17 80.81,134.66 70.91,134.66 70.4,135.17 65.32,135.17 64.81,134.66 63.54,134.66 63.03,135.17 58.75,135.17 58.25,134.66 39.41,134.66 U1.14
E2: length 96.5
  Bottom Layer w0.254: J5.1 120.69,134.15 112.31,134.15 108.75,137.71 39.92,137.71 U1.15
E3: length 111.9
  Bottom Layer w0.254: J6.1 133.64,134.66 125.69,134.66 123.15,137.2 113.24,137.2 111.72,138.73 38.39,138.73 U1.16
E4: length 127.3
  Bottom Layer w0.254: U1.17 36.36,139.23 111.97,139.23 112.48,138.73 142.78,138.73 J7.1
E5: length 150.9
  Bottom Layer w0.254: U1.20 19.18,127.13 28.32,127.13 29.34,128.14 29.34,128.65 38.9,138.22 108.93,138.22 112.48,134.66 119.34,134.66 121.12,136.44 123.15,136.44 126.2,133.39 157.77,133.39 J8.1
E6: length 167.3
  Top Layer w0.254: J9.1 171.74,134.66 163.53,134.66 161.76,136.44 158.96,136.44 157.19,134.66 147.96,134.66 146.69,133.39 145.5,133.39 144.23,134.66 135.3,134.66 134.03,133.39 126.96,133.39 124.08,136.27 114.94,136.27 111.63,139.57 v1(111.63,139.83)
  Bottom Layer w0.254: U1.21 18.67,131.7 28.07,131.7 36.2,139.83 v1(111.63,139.83)
FP1: length 52
  Top Layer w0.254: RV1.2 17.14,31.3 18.67,31.3 33.4,46.03 33.4,67.87 37.28,71.76 U3.9
FP2: length 31.9
  Top Layer w0.254: v1(38.48,60.64) 38.73,60.64 39.24,61.14 39.24,61.91 38.48,62.67 37.96,62.67 U3.2
  Bottom Layer w0.254: v1(38.48,60.64) 30.1,52.25 21.21,52.25 RV2.2
LED: length 16.8
  Top Layer w0.2: U1.6 22.48,111.13 34.1,111.13 U4.1
LEDCNTRL: length 48.6
  Top Layer w0.2: U4.20 37.48,110.69 v1(38.06,111.27) ; v1(47.2,108.73) 48.41,109.94 59.08,109.94 65.94,116.8 68.48,116.8 72.29,112.99 D1.4
  Bottom Layer w0.2: v1(47.2,108.73) 42.63,108.73 40.09,111.27 v1(38.06,111.27)
MAIN: length 13.7
  Top Layer w0.254: U3.23 20.9,62.87 18.8,60.76 17.27,60.76 RV3.2
MIDI_IN: length 27.6
  Top Layer w0.2: R1.1 37.91,114.3 35.37,114.3 34.6,113.54 34.6,112.52 35.87,111.25 37.22,111.25 37.98,112.01 38.24,112.01 38.75,111.51 38.75,111 38.24,110.49 38.24,109.22 38.11,109.1 U4.19
  Top Layer w0.254: 48.26,120.02 47.25,120.02 38.75,111.51
MIDI_OUT: length 62
  Top Layer w0.2: U4.18 38.24,108.7 38.61,109.07 38.61,110.02 47.24,118.65 49.28,118.65 65.53,134.91 69.85,134.91 70.61,134.15 80.26,134.15 82.3,136.18 J3.3
MIDII3: length 32.2
  Top Layer w0.2: U1.0 9.02,109.35 34.16,109.35 34.41,109.1 U4.2
MIDIO3: length 33.5
  Top Layer w0.2: U4.3 36.41,108.7 36.55,108.84 36.55,109.86 34.77,111.63 30.61,111.63 29.34,112.9 29.34,113.41 28.32,114.43 9.02,114.43 U1.1
MRC: length 81.9
  Top Layer w0.254: v1(37.72,60.83) 37.72,61.55 U3.1
  Bottom Layer w0.254: v1(37.72,60.83) 19.18,79.38 19.18,104.78 18.16,105.79 16.13,105.79 9.02,112.9 9.02,127.13 U1.23
MRR: length 61.1
  Top Layer w0.254: U1.22 14.1,129.67 23.24,129.67 24.26,128.65 24.26,128.14 32.89,119.51 36.7,119.51 v1(41.28,114.94) ; U2.1 54.02,96.65 53.47,96.65 51.69,98.43 v1(51.69,107.32)
  Bottom Layer w0.254: v1(41.28,114.94) 44.07,114.94 v1(51.69,107.32)
MUXC1: length 46.8
  Top Layer w0.254: v1(28.58,105.28) 29.08,105.79 29.59,105.79 36.27,99.11 36.27,73.96 37.21,73.03 U3.10
  Bottom Layer w0.254: U1.8 25.53,108.33 v1(28.58,105.28)
MUXC2: length 51
  Top Layer w0.254: v1(37.47,95.12) 39.24,93.35 39.24,75.31 38.23,74.3 U3.11
  Bottom Layer w0.254: U1.9 26.8,114.43 25.27,114.43 24.26,113.41 24.26,108.33 v1(37.47,95.12)
MUXC3: length 41.5
  Top Layer w0.254: U3.14 27.56,74.3 26.8,75.06 26.8,104.52 v1(28.83,106.55)
  Bottom Layer w0.254: U1.10 28.83,111.38 v1(28.83,106.55)
MUXC4: length 39.6
  Top Layer w0.254: U3.13 29.34,76.63 v1(29.34,105.03)
  Bottom Layer w0.254: v1(29.34,105.03) 29.59,105.28 29.59,109.6 U1.11
MUXR1: length 49.8
  Top Layer w0.254: v1(51.94,108.08) 54.02,108.08 U2.10
  Bottom Layer w0.254: U1.2 14.86,117.73 30.61,117.73 31.37,116.97 43.05,116.97 v1(51.94,108.08)
MUXR2: length 46.2
  Top Layer w0.254: v1(48.51,109.22) U2.11
  Bottom Layer w0.254: U1.3 16.76,117.09 28.19,117.09 30.99,114.3 43.43,114.3 v1(48.51,109.22)
MUXR3: length 30.9
  Top Layer w0.254: U1.4 18.67,109.86 v1(34.42,109.86) ; v1(40.51,109.35) 44.53,109.35 U2.14
  Bottom Layer w0.254: v1(40.51,109.35) 40,109.86 v1(34.42,109.86)
MUXR4: length 27.9
  Top Layer w0.254: v1(33.15,110.49) 20.57,110.49 U1.5 ; v1(40,110.49) U2.13
  Bottom Layer w0.254: v1(33.15,110.49) v1(40,110.49)
ROW1: length 157
  Top Layer w0.254: SW1.1 84.74,117.77 80.78,113.82 80.78,106.75 74.69,100.66 73.92,100.66 v1(73.16,99.9) ; U2.9 58.36,106.68 60.21,108.53 60.72,108.53 61.48,107.77 61.48,105.99 R7.1
  Bottom Layer w0.254: 73.42,98.88 66.56,98.88 R7.1 ; 73.42,98.88 73.42,99.64 v1(73.16,99.9) ; 73.42,98.88 84.96,98.88 SW8.1 84.99,95.8 84.99,78.02 SW15.1 84.86,74.59 84.86,56.94 SW22.1 84.86,53.38 84.86,35.73 SW29.1 85.12,32.43 85.12,14.39 SW36.1
ROW2: length 165.3
  Top Layer w0.254: U2.8 58.38,105.41 R6.1
  Bottom Layer w0.254: 102.37,97.34 101.36,97.34 99.32,99.37 74.69,99.37 73.16,100.89 67.07,100.89 R6.1 ; 102.37,97.34 SW9.1 100.87,95.54 100.87,78.15 SW16.1 101.12,74.84 101.12,56.81 SW23.1 101.25,53.63 101.25,35.6 SW30.1 101.12,32.17 101.12,14.52 SW37.1 ; 102.37,97.34 101.1,98.61 101.1,116.23 SW2.1
ROW3: length 184.8
  Top Layer w0.254: 117.96,97.2 SW10.1 ; 117.96,97.2 117.2,97.2 ; 117.96,97.2 117.96,100.75 112.88,105.83 112.88,113.71 116.94,117.77 SW3.1 ; U2.7 58.76,104.14 R8.1 66.56,96.34 72.65,96.34 73.42,95.58 110.75,95.58 112.37,97.2 117.2,97.2 ; 117.2,97.2 v1(117.2,96.94)
  Bottom Layer w0.254: v1(117.2,96.94) 116.87,96.61 116.87,78.02 SW17.1 120.42,74.46 120.42,56.94 SW24.1 117.12,53.63 117.12,35.47 SW31.1 120.3,32.3 120.3,14.26 SW38.1
ROW4: length 214.8
  Top Layer w0.254: 133.58,97.07 132.82,97.07 130.82,95.07 73.16,95.07 72.4,95.83 64.53,95.83 R9.1 57.49,102.87 U2.6 53.68,102.87 52.59,103.96 52.59,107.01 52.84,107.26 57.67,107.26 R5.1 ; 133.58,97.07 134.34,97.07 ; 133.58,97.07 133.58,103.16 129.52,107.23 129.52,113.58 133.58,117.64 135.03,117.64 SW4.1 ; 134.34,97.07 134.34,95.8 v1(133.83,95.29) ; 134.34,97.07 SW11.1
  Bottom Layer w0.254: v1(133.83,95.29) 133.83,77.56 SW18.1 133.88,74.46 133.88,56.81 SW25.1 133.88,53.25 133.88,35.6 SW32.1 137.44,32.04 137.44,14.26 SW39.1
ROW5: length 217.5
  Top Layer w0.254: 147.8,96.81 SW12.1 152.43,93 v1(152.68,92.75) ; 147.8,96.81 146.79,97.83 146.79,113.4 151.03,117.64 SW5.1 ; 147.8,96.81 147.3,96.81 145.04,94.56 69.1,94.56 68.34,93.8 64.02,93.8 R10.1 56.22,101.6 U2.5
  Bottom Layer w0.254: SW40.1 151.03,14.01 151.03,31.79 SW33.1 151.16,35.22 151.16,53.25 SW26.1 154.46,56.56 154.46,74.08 SW19.1 154.46,77.64 154.46,90.97 v1(152.68,92.75)
ROW6: length 257.9
  Top Layer w0.254: 162.1,85.09 71.93,85.09 60.75,96.27 60.24,96.27 56.18,100.33 U2.4 54.14,100.32 53.59,100.32 52.58,99.31 v1(52.58,98.54) ; 162.1,85.09 163.37,86.36 163.37,92.64 167.43,96.71 ; 162.1,85.09 162.1,83.57 v1(164.64,81.03) ; 167.43,96.71 168.96,96.71 SW13.1 ; 167.43,96.71 162.86,101.28 162.86,113.47 167.16,117.77 SW6.1
  Bottom Layer w0.254: R15.1 52.58,83.56 v1(52.58,98.54) ; SW41.1 167.29,14.26 167.29,31.92 SW34.1 167.29,35.47 167.29,53.13 SW27.1 167.29,56.68 167.29,74.08 168.39,75.18 ; 168.39,75.18 165.15,75.18 164.64,75.69 v1(164.64,81.03) ; 168.39,75.18 SW20.1
ROW7: length 249.4
  Top Layer w0.254: U2.3 54.22,99.13 56.14,99.13 R11.1 ; v1(117.07,97.83) 115.29,99.61 73.89,99.61 71.35,97.07 v1(71.1,97.07)
  Bottom Layer w0.254: SW42.1 184.43,14.26 184.43,31.92 SW35.1 184.56,35.35 184.56,53.38 SW28.1 184.43,56.56 184.43,74.34 SW21.1 184.3,77.51 184.3,95.29 SW14.1 185.65,96.81 ; v1(71.1,97.07) 70.37,96.34 61.99,96.34 R11.1 ; 185.65,96.81 184.63,96.81 182.6,98.85 118.09,98.85 v1(117.07,97.83) ; 185.65,96.81 184.18,98.29 184.18,116.25 SW7.1
SCL: length 31
  Top Layer w0.254: U1.19 20.45,115.95 v1(21.21,115.19)
  Bottom Layer w0.254: J10.3 21.72,102.87 23.5,102.87 24.26,103.63 24.26,107.06 21.72,109.6 21.72,114.68 v1(21.21,115.19)
SDA: length 27.4
  Top Layer w0.254: v1(21.46,116.46) 22.99,117.98 U1.18
  Bottom Layer w0.254: J10.4 19.18,107.95 19.18,114.17 v1(21.46,116.46)
TPWR: length 24.6
  Top Layer w0.254: U1.VIN 2.67,128.91 13.08,139.32 22.41,139.32 SW49.2
$1N1: length 109.6
  Top Layer w0.254: D35.2 181.59,22.65 167.41,8.47 80.16,8.47 D36.4
$1N4: length 15.2
  Top Layer w0.254: D15.2 90.15,65.83 D16.4
$1N5: length 21.1
  Top Layer w0.254: D26.3 149.2,50.51 161.9,50.51 162.16,50.25 162.16,45.2 D27.1
$1N6: length 14.2
  Bottom Layer w0.254: D43.1 57.92,115.43 52.88,120.48 R3.1
$1N7: length 21.1
  Top Layer w0.254: D30.1 96.24,24.38 96.24,29.17 95.73,29.68 83.29,29.68 D29.3
$1N8: length 21.9
  Top Layer w0.254: D5.1 145.52,108.45 145.52,113.63 145.26,113.88 131.55,113.88 D4.3
$1N11: length 14.8
  Top Layer w0.254: D24.1 105.9,49.62 D23.3
$1N12: length 21.2
  Top Layer w0.254: D4.1 128.37,108.7 128.37,113.75 128.12,114.01 114.91,114.01 D3.3
$1N13: length 21
  Top Layer w0.254: D22.2 83.29,43.35 95.73,43.35 95.99,43.6 95.99,48.78 D23.4
$1N15: length 15.3
  Top Layer w0.254: D37.1 90.15,7.2 D36.3
$1N17: length 21.5
  Top Layer w0.254: D12.1 145.52,87.37 145.52,92.42 145.26,92.67 131.8,92.67 D11.3
$1N19: length 16
  Top Layer w0.254: D31.3 122.79,28.28 D32.1
$1N20: length 21.9
  Top Layer w0.254: D18.3 129.77,69.68 129.77,64.86 130.02,64.6 144.09,64.6 D19.1
$1N23: length 16.3
  Top Layer w0.254: D34.2 173.59,23.15 D35.4
$1N24: length 16.2
  Bottom Layer w0.254: J3.4 78.12,133.68 R4.2
$1N25: length 21.4
  Top Layer w0.254: D10.3 114.78,92.8 128.5,92.8 128.75,92.54 128.75,87.62 D11.1
$1N26: length 16.1
  Top Layer w0.254: D20.3 173.33,70.57 D21.1
$1N27: length 15.9
  Top Layer w0.254: D38.3 122.66,7.07 D39.1
$1N29: length 21.7
  Top Layer w0.254: D18.1 126.82,64.73 113.13,64.73 112.88,64.98 112.88,69.81 D17.3
$1N30: length 113.6
  Top Layer w0.254: v1(169.65,108.29) 176.76,108.29 D7.3 ; v1(103.35,86.45) 102.85,85.94 80.11,85.94 D8.1
  Bottom Layer w0.254: v1(103.35,86.45) 116.31,99.4 160.76,99.4 v1(169.65,108.29)
$1N31: length 15.1
  Top Layer w0.254: D9.3 106.02,92.04 D10.1
$1N32: length 16
  Top Layer w0.254: D14.4 173.33,86.65 D13.2
$1N33: length 16.1
  Top Layer w0.254: D33.1 139.8,28.15 D32.3
$1N34: length 21
  Top Layer w0.254: D16.1 94.05,64.73 81.26,64.73 81,64.98 81,69.81 D15.3
$1N37: length 21.6
  Top Layer w0.254: D6.1 162.41,108.58 162.41,113.37 161.9,113.88 148.95,113.88 D5.3
$1N38: length 15.5
  Top Layer w0.254: D19.2 156.19,65.45 D20.4
$1N39: length 21.9
  Top Layer w0.254: D21.4 179.3,69.6 179.3,64.81 178.79,64.3 165.58,64.3 D20.2
$1N40: length 120.4
  Top Layer w0.254: D35.3 179.55,26.12 179.55,22.31 176.51,19.26 173.2,19.26 163.04,9.1 79.15,9.1 77.88,7.83 77.88,3.22 D36.1
$1N43: length 21.8
  Top Layer w0.254: D24.3 114.91,50.63 128.63,50.63 128.88,50.38 128.88,45.46 D25.1
$1N45: length 109.3
  Top Layer w0.254: D22.4 80.54,51.14 167.56,51.14 181.33,64.92 D21.2
$1N46: length 21.9
  Top Layer w0.254: D32.2 132.18,21.88 145.65,21.88 145.9,22.14 145.9,27.06 D33.4
$1N51: length 21.3
  Top Layer w0.254: D12.2 148.69,85.51 161.9,85.51 162.16,85.77 162.16,90.69 D13.4
$1N54: length 15.7
  Top Layer w0.254: D6.3 169.44,107.61 D7.1
$1N56: length 109.1
  Top Layer w0.254: D15.4 80.29,72.1 167.54,72.1 170.54,75.1 170.54,75.35 181.21,86.02 D14.2
$1N57: length 21.1
  Top Layer w0.254: D37.4 96.12,6.23 96.12,1.44 95.61,0.93 83.16,0.93 D36.2
$1N58: length 20.9
  Top Layer w0.254: D9.1 95.99,88 95.99,92.8 95.48,93.31 83.29,93.31 D8.3
$1N59: length 21.1
  Top Layer w0.254: D41.1 162.28,2.79 162.28,7.71 162.03,7.96 149.33,7.96 D40.3
$1N60: length 22
  Top Layer w0.254: D14.1 178.21,89.67 179.17,90.64 179.17,92.42 178.92,92.67 171.3,92.67 170.03,91.4 164.44,91.4 D13.3
$1N61: length 111.2
  Top Layer w0.254: v1(162.71,92.04) 161.95,92.8 157.12,92.8 156.36,92.04 148.99,92.04 147.22,93.81 80.8,93.81 D8.4 ; D7.2 181.08,107.36 170.66,96.94 170.66,96.18 166.6,92.12 165.33,92.12 v1(165.25,92.04)
  Bottom Layer w0.254: v1(165.25,92.04) v1(162.71,92.04)
$1N62: length 15.4
  Top Layer w0.254: D34.1 156.44,28.03 D33.3
$1N63: length 22.7
  Top Layer w0.254: D41.3 176.76,6.82 178.03,8.09 179.81,8.09 180.06,7.83 180.06,2.91 D42.1
$1N64: length 16.2
  Top Layer w0.254: D25.3 139.68,49.49 D26.1
$1N65: length 20.5
  Top Layer w0.254: D30.3 99.29,29.42 111.74,29.42 111.99,29.17 111.99,24.25 D31.1
$1N66: length 21
  Top Layer w0.254: D34.4 162.16,27.31 162.16,22.27 161.9,22.01 148.95,22.01 D33.2
$1N68: length 14.8
  Top Layer w0.254: D16.3 105.9,70.83 D17.1
$1N70: length 120.3
  Top Layer w0.254: D22.1 78,45.63 78,50.25 79.53,51.78 163.28,51.78 173.19,61.68 176.76,61.68 179.81,64.73 179.81,69.05 D21.3
$1N71: length 15.1
  Top Layer w0.254: D2.3 105.9,112.99 D3.1
$1N74: length 21.1
  Top Layer w0.254: D2.1 95.86,108.96 95.86,113.75 95.35,114.26 82.91,114.26 D1.3
$1N75: length 21.6
  Top Layer w0.254: D31.2 115.29,22.01 128.5,22.01 128.75,22.27 128.75,27.31 D32.4
$1N78: length 20.9
  Top Layer w0.254: D3.4 111.86,112.02 111.86,107.23 111.35,106.72 99.16,106.72 D2.2
$1N79: length 16.2
  Top Layer w0.254: D27.3 173.46,49.36 D28.1
$1N82: length 22.1
  Top Layer w0.254: D34.3 165.58,29.42 179.17,29.42 179.43,29.17 179.43,27.14 178.59,26.3 D35.1
$1N90: length 109.3
  Top Layer w0.254: D28.2 181.46,43.86 167.74,30.14 80.75,30.14 D29.4
$1N92: length 21.3
  Top Layer w0.254: D19.3 146.91,69.43 146.91,64.6 147.17,64.35 160.09,64.35 D20.1
$1N93: length 15.9
  Top Layer w0.254: D18.4 122.91,65.83 D17.2
$1N94: length 22
  Top Layer w0.254: D26.4 145.9,48.27 145.9,43.47 145.39,42.97 132.44,42.97 D25.2
$1N96: length 15
  Top Layer w0.254: D38.1 105.9,7.2 D37.3
$1N97: length 19.2
  Top Layer w0.254: J2.5 56.65,136.04 v1(56.65,130.19)
  Bottom Layer w0.254: v1(56.65,130.19) 59.7,127.14 D43.2 59.2,123.33 55.88,120.02
$1N107: length 15.2
  Top Layer w0.254: D22.3 90.15,49.62 D23.1
$1N108: length 22
  Top Layer w0.254: D39.3 131.8,7.96 145.52,7.96 146.03,7.45 146.03,2.66 D40.1
$1N112: length 15.7
  Top Layer w0.254: D3.2 122.66,107.99 D4.4
$1N121: length 15.5
  Top Layer w0.254: D27.4 156.19,44.24 D26.2
$1N122: length 22.7
  Bottom Layer w0.254: J1.1 22.62,134.44 C1.2 24.22,135.54 SW49.6 27.93,138.1 SW49.4
$1N123: length 15.5
  Top Layer w0.254: D12.3 156.31,91.53 D13.1
$1N124: length 16.1
  Top Layer w0.254: D5.4 139.93,107.86 D4.2
$1N125: length 15.3
  Top Layer w0.254: D30.4 90.27,23.41 D29.2
$1N126: length 16.2
  Top Layer w0.254: D39.2 140.31,1.95 D40.4
$1N127: length 16.1
  Top Layer w0.254: D19.4 140.19,65.7 D18.2
$1N128: length 15.8
  Top Layer w0.254: D6.4 156.44,107.61 D5.2
$1N131: length 15.9
  Top Layer w0.254: D12.4 139.8,86.65 D11.2
$1N132: length 119.8
  Top Layer w0.254: D15.1 78,66.84 78,71.46 79.27,72.73 163.16,72.73 173.06,82.64 176.12,82.64 179.17,85.69 179.17,89.5 D14.3
$1N133: length 20.6
  Top Layer w0.254: D23.2 99.42,43.35 111.35,43.35 111.86,43.86 111.86,48.65 D24.4
$1N134: length 14.8
  Top Layer w0.254: D31.4 106.15,23.41 D30.2
$1N136: length 22
  Top Layer w0.254: D28.4 177.36,50.46 163.55,50.46 163.3,50.21 163.3,45.38 D27.2
$1N138: length 120.2
  Top Layer w0.254: D28.3 179.43,47.33 179.43,43.52 176.38,40.47 173.08,40.47 163.17,30.57 79.53,30.57 78,29.04 78,24.42 D29.1
$1N139: length 15.1
  Top Layer w0.254: D8.2 90.02,87.04 D9.4
$1N141: length 21.5
  Top Layer w0.254: D6.2 163.43,108.63 163.43,113.45 163.68,113.71 176.98,113.71 D7.4
$1N142: length 20.6
  Top Layer w0.254: D38.4 111.86,6.23 111.86,1.18 111.61,0.93 99.42,0.93 D37.2
$1N144: length 16.9
  Top Layer w0.254: D41.2 173.97,1.82 D42.4
$1N145: length 15.4
  Top Layer w0.254: D40.2 156.19,1.69 D41.4
$1N146: length 20.6
  Top Layer w0.254: D16.2 99.42,64.56 111.35,64.56 111.86,65.06 111.86,69.86 D17.4
$1N147: length 15.3
  Top Layer w0.254: D1.2 89.89,107.99 D2.4
$1N148: length 20.8
  Top Layer w0.254: D9.2 97,88.05 97,92.88 97.26,93.13 109.93,93.13 D10.4
$1N149: length 21.7
  Top Layer w0.254: D38.2 115.29,0.8 128.5,0.8 128.75,1.06 128.75,5.98 D39.4
$1N151: length 15.7
  Top Layer w0.254: D10.2 123.17,87.04 D11.4
$1N152: length 16
  Top Layer w0.254: D24.2 123.04,44.62 D25.4
$1N2399: length 4.8
  Bottom Layer w0.254: R2.2 45.91,119.82 48.26,117.48
$1N19678: length 17
  Bottom Layer w0.254: J2.4 53.2,133.55 R3.2

## Text on the board
Document Layer: MOARkNOBS-42
Top Silkscreen Layer: MAIN | f1 | f2 | brain | PWR | MOAR k NOBS - 42 | v1.04 | MIDI OUT | 1x2 | 1x1 | LED | MIDI IN | EF1 | EF2 | EF3 | EF4 | EF5 | EF6 | 7x6 | \\  |  / / CNTRL / /  |  \\
